# Altium schematic sheet 习题二.SchDoc
size A3
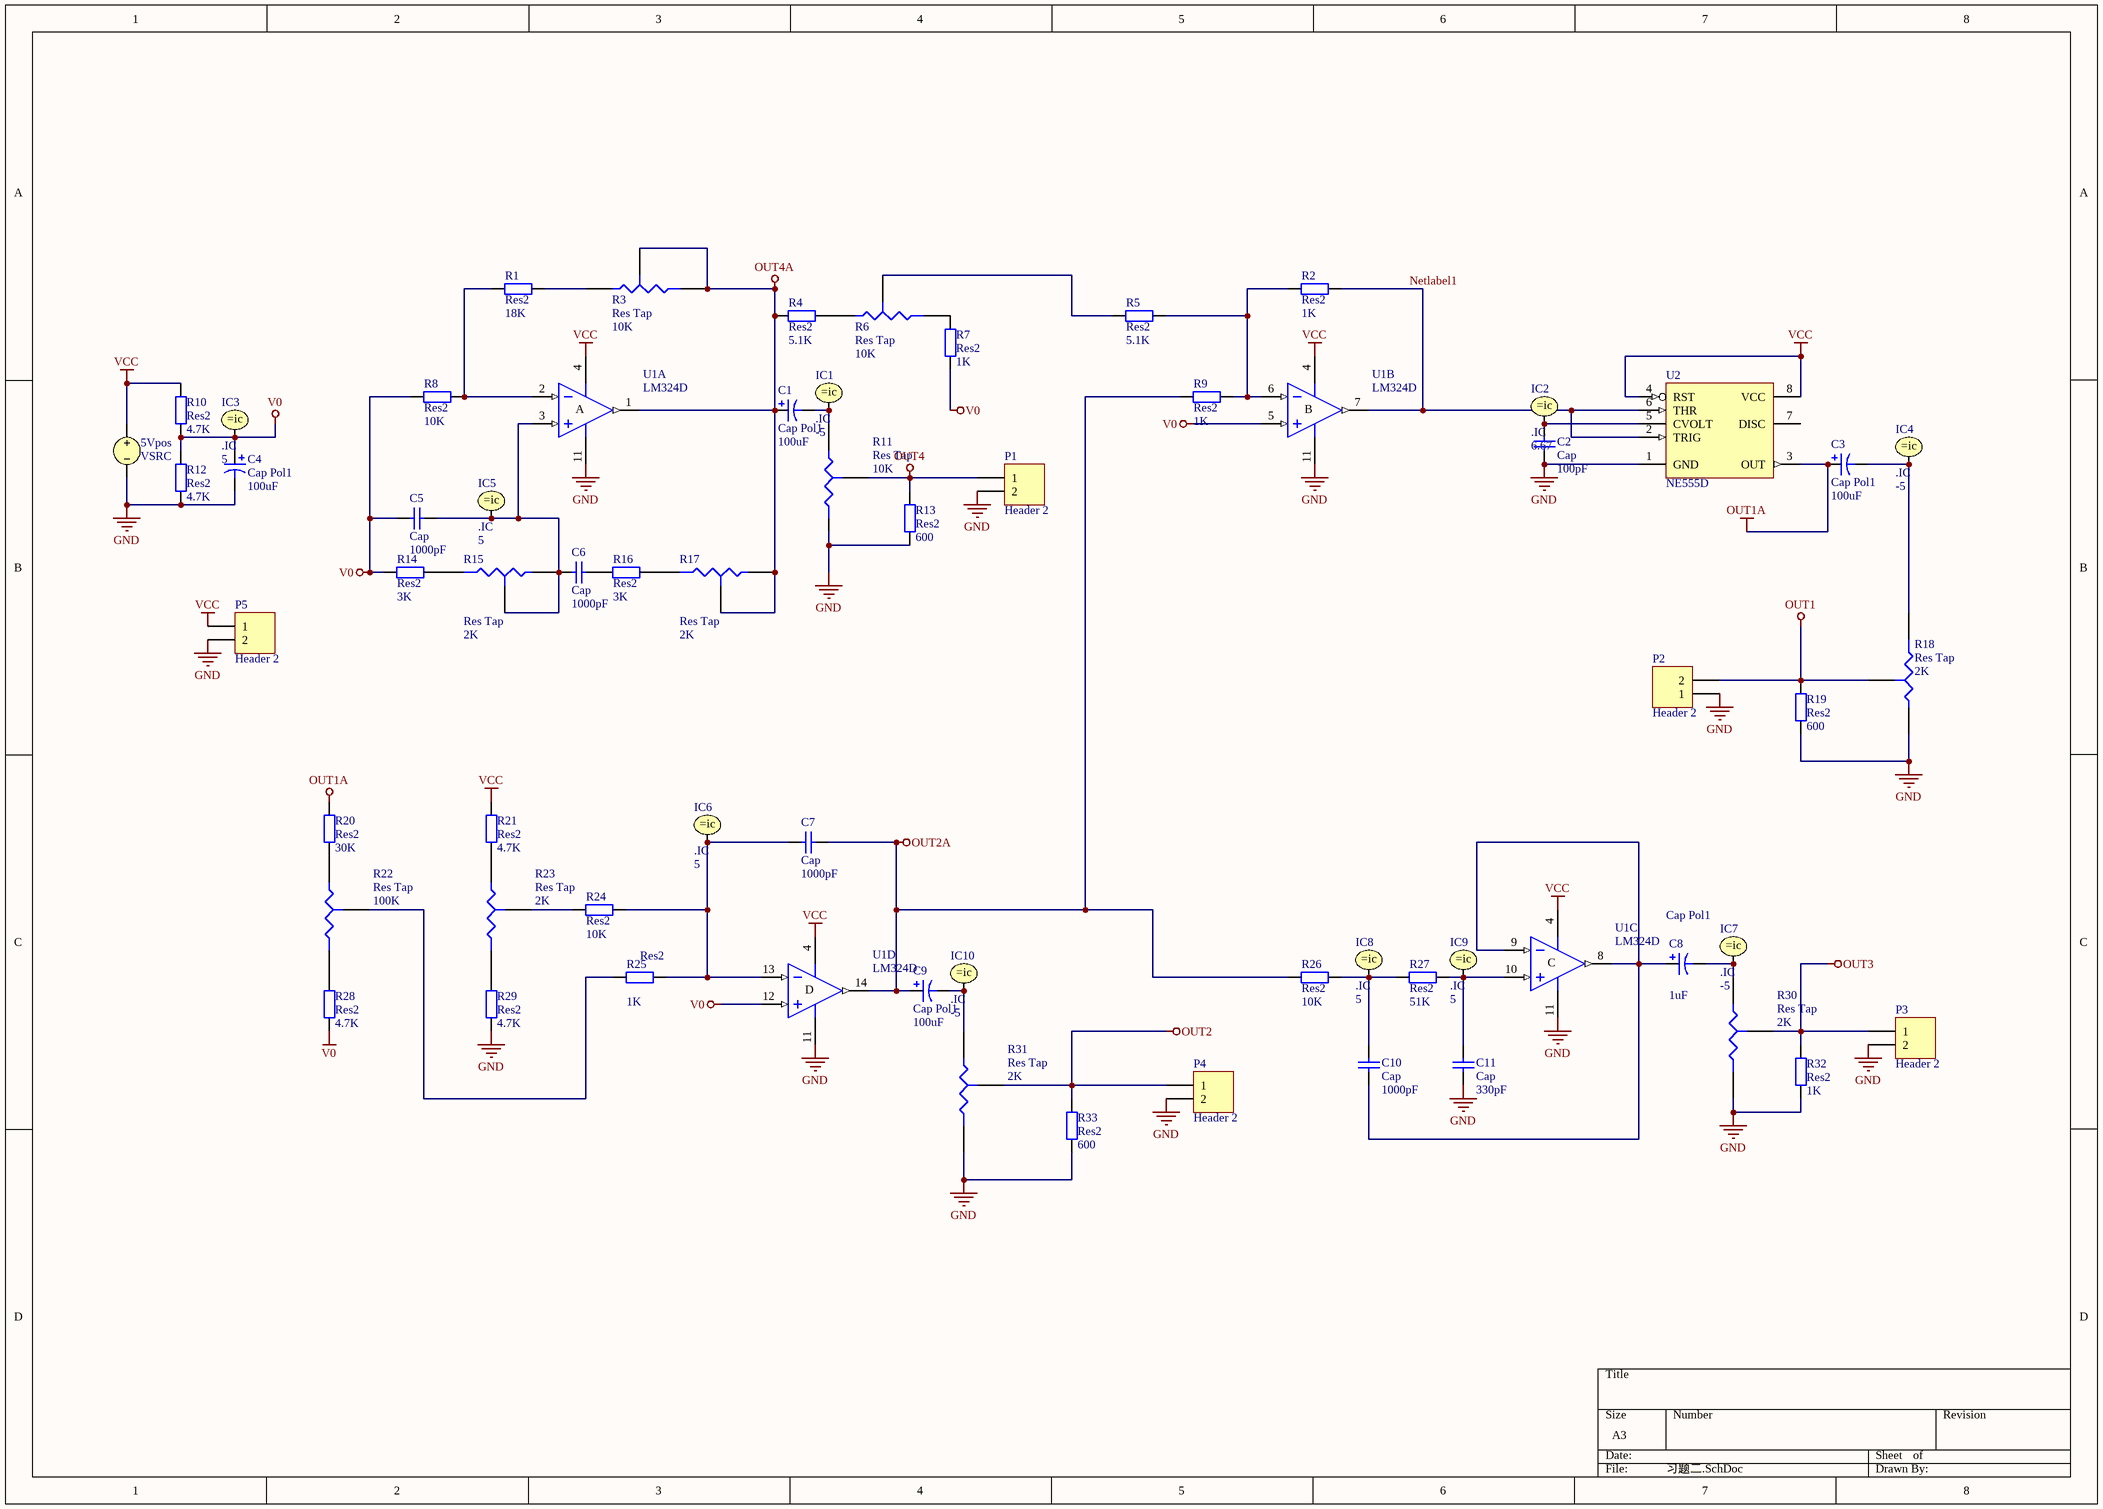
[diagram p0: 习题二.SchDoc]

## Parts
5Vpos  VSRC  [PIN1]
C1  Cap Pol1  value 100uF  [LC-CASE-C_6032]
C2  Cap  value 100pF  [LC-0805_C]
C3  Cap Pol1  value 100uF  [LC-CASE-C_6032]
C4  Cap Pol1  value 100uF  [C-RB-5.0/10]
C5  Cap  value 1000pF  [LC-0805_C]
C6  Cap  value 1000pF  [LC-0805_C]
C7  Cap  value 1000pF  [LC-0805_C]
C8  Cap Pol1  value 1uF  [LC-CASE-C_6032]
C9  Cap Pol1  value 100uF  [LC-CASE-C_6032]
C10  Cap  value 1000pF  [LC-0805_C]
C11  Cap  value 330pF  [LC-0805_C]
IC1  .IC  Initial Voltage: -5
IC2  .IC  Initial Voltage: 6.67
IC3  .IC  Initial Voltage: 5
IC4  .IC  Initial Voltage: -5
IC5  .IC  Initial Voltage: 5
IC6  .IC  Initial Voltage: 5
IC7  .IC  Initial Voltage: -5
IC8  .IC  Initial Voltage: 5
IC9  .IC  Initial Voltage: 5
IC10  .IC  Initial Voltage: -5
P1  Header 2  [HDR1X2]
P2  Header 2  [HDR1X2]
P3  Header 2  [HDR1X2]
P4  Header 2  [HDR1X2]
P5  Header 2  [HDR1X2]
R1  Res2  value 18K  [LC-0805_R]
R2  Res2  value 1K  [LC-0805_R]
R3  Res Tap  value 10K  [电位器]
R4  Res2  value 5.1K  [LC-0805_R]
R5  Res2  value 5.1K  [LC-0805_R]
R6  Res Tap  value 10K  [电位器]
R7  Res2  value 1K  [LC-0805_R]
R8  Res2  value 10K  [LC-0805_R]
R9  Res2  value 1K  [LC-0805_R]
R10  Res2  value 4.7K  [LC-0805_R]
R11  Res Tap  value 10K  [电位器]
R12  Res2  value 4.7K  [LC-0805_R]
R13  Res2  value 600  [LC-0805_R]
R14  Res2  value 3K  [LC-0805_R]
R15  Res Tap  value 2K  [电位器]
R16  Res2  value 3K  [LC-0805_R]
R17  Res Tap  value 2K  [电位器]
R18  Res Tap  value 2K  [电位器]
R19  Res2  value 600  [LC-0805_R]
R20  Res2  value 30K  [LC-0805_R]
R21  Res2  value 4.7K  [LC-0805_R]
R22  Res Tap  value 100K  [电位器]
R23  Res Tap  value 2K  [电位器]
R24  Res2  value 10K  [LC-0805_R]
R25  Res2  value 1K  [LC-0805_R]
R26  Res2  value 10K  [LC-0805_R]
R27  Res2  value 51K  [LC-0805_R]
R28  Res2  value 4.7K  [LC-0805_R]
R29  Res2  value 4.7K  [LC-0805_R]
R30  Res Tap  value 2K  [电位器]
R31  Res Tap  value 2K  [电位器]
R32  Res2  value 1K  [LC-0805_R]
R33  Res2  value 600  [LC-0805_R]
U1  LM324D  [SO14_N]  (parts A,B,C,D of 4)
U2  NE555D  [D008_N]

## Nets
GND: 5Vpos.2 C2.1 C4.2 C11.1 P1.2 P2.1 P3.2 P4.2 P5.2 R11.2(B) R12.1 R13.1 R18.1(A) R19.1 R29.1 R30.2(B) R31.2(B) R32.1 R33.1 U1.11(V-) U2.1(GND)
OUT1: P2.2 R18.3(TAP) R19.2
OUT1A: C3.1 R20.2 U2.3(OUT)
OUT2: P4.1 R31.3(TAP) R33.2
OUT2A: C7.2 C9.1 R9.1 R26.1 U1.14(OUT)
OUT3: P3.1 R30.3(TAP) R32.2
OUT4: P1.1 R11.3(TAP) R13.2
OUT4A: C1.1 R3.2(B) R3.3(TAP) R4.1 R17.1(A) R17.3(TAP) U1.1(OUT)
V0: C4.1 C5.1 IC3.1 R7.1 R8.1 R10.1 R12.2 R14.1 R28.1 U1.5(IN+) U1.12(IN+)
VCC: 5Vpos.1 P5.1 R10.2 R21.2 U1.4(V+) U2.4(RST) U2.8(VCC)
Netlabel1: R2.2 U1.7(OUT) U2.2(TRIG) U2.6(THR)
NetC1_2: C1.2 IC1.1 R11.1(A)
NetC2_2: C2.2 IC2.1 U2.5(CVOLT)
NetC3_2: C3.2 IC4.1 R18.2(B)
NetC5_2: C5.2 C6.1 IC5.1 R15.1(A) R15.3(TAP) U1.3(IN+)
NetC6_2: C6.2 R16.1
NetC7_1: C7.1 IC6.1 R24.2 R25.2 U1.13(IN-)
NetC8_1: C8.1 C10.1 U1.8(OUT) U1.9(IN-)
NetC8_2: C8.2 IC7.1 R30.1(A)
NetC9_2: C9.2 IC10.1 R31.1(A)
NetC10_2: C10.2 IC8.1 R26.2 R27.1
NetC11_2: C11.2 IC9.1 R27.2 U1.10(IN+)
NetR1_1: R1.1 R8.2 U1.2(IN-)
NetR1_2: R1.2 R3.1(A)
NetR2_1: R2.1 R5.2 R9.2 U1.6(IN-)
NetR4_2: R4.2 R6.1(A)
NetR5_1: R5.1 R6.3(TAP)
NetR6_2: R6.2(B) R7.2
NetR14_2: R14.2 R15.2(B)
NetR16_2: R16.2 R17.2(B)
NetR20_1: R20.1 R22.1(A)
NetR21_1: R21.1 R23.1(A)
NetR22_2: R22.2(B) R28.2
NetR22_3: R22.3(TAP) R25.1
NetR23_2: R23.2(B) R29.2
NetR23_3: R23.3(TAP) R24.1

Not connected (* = marked no-connect by the designer): U2 7(DISC)

## Notes on the sheet
- (in symbol LM324D, part A) A
- (in symbol LM324D, part B) B
- (in symbol LM324D, part C) C
- (in symbol LM324D, part D) D

## Library data of the parts
5Vpos = VSRC: Voltage Source; Note: PCB Footprint - Not required; Value: +10; Published: 8-Jun-2000; LatestRevisionDate: 17-Jul-2002; LatestRevisionNote: Re-released for DXP Platform.; PackageReference: Not Applicable; Publisher: Altium Limited
C1 C3 C4 C8 C9 = Cap Pol1: Polarized Capacitor (Radial); Published: 8-Jun-2000; LatestRevisionDate: 17-Jul-2002; LatestRevisionNote: Re-released for DXP Platform.; PackageReference: RB7.6-15; Publisher: Altium Limited
C2 C5-C7 C10 C11 = Cap: Capacitor; Published: 8-Jun-2000; LatestRevisionDate: 17-Jul-2002; LatestRevisionNote: Re-released for DXP Platform.; PackageReference: RAD-0.3; Publisher: Altium Limited
IC1-IC10 = .IC: Initial Condition; Published: 8-Jun-2000; LatestRevisionDate: 17-Jul-2002; LatestRevisionNote: Re-released for DXP Platform.; PackageReference: Not Applicable; Publisher: Altium Limited
P1-P5 = Header 2: Header, 2-Pin; LatestRevisionDate: 17-Jul-2002; LatestRevisionNote: Re-released for DXP Platform.; Publisher: Altium Limited
R1 R2 R4 R5 R7-R10 R12-R14 R16 R19-R21 R24-R29 R32 R33 = Res2: Resistor; Published: 8-Jun-2000; LatestRevisionDate: 17-Jul-2002; LatestRevisionNote: Re-released for DXP Platform.; PackageReference: AXIAL-0.4; Publisher: Altium Limited
R3 R22 R23 = Res Tap: Tapped Resistor; Sim Note: Enter the Resistance value and the set point into parameter fields.; Set Position: 0.5; Published: 24-Mar-1999; LatestRevisionDate: 17-Jul-2002; LatestRevisionNote: Re-released for DXP Platform.; PackageReference: VR3; Publisher: Altium Limited
R6 R30 = Res Tap: Tapped Resistor; Sim Note: Enter the Resistance value and the set point into parameter fields.; Set Position: 0.8; Published: 24-Mar-1999; LatestRevisionDate: 17-Jul-2002; LatestRevisionNote: Re-released for DXP Platform.; PackageReference: VR3; Publisher: Altium Limited
R11 = Res Tap: Tapped Resistor; Sim Note: Enter the Resistance value and the set point into parameter fields.; Set Position: 0.69; Published: 24-Mar-1999; LatestRevisionDate: 17-Jul-2002; LatestRevisionNote: Re-released for DXP Platform.; PackageReference: VR3; Publisher: Altium Limited
R15 R17 = Res Tap: Tapped Resistor; Sim Note: Enter the Resistance value and the set point into parameter fields.; Set Position: 0.9; Published: 24-Mar-1999; LatestRevisionDate: 17-Jul-2002; LatestRevisionNote: Re-released for DXP Platform.; PackageReference: VR3; Publisher: Altium Limited
R18 = Res Tap: Tapped Resistor; Sim Note: Enter the Resistance value and the set point into parameter fields.; Set Position: 0.15; Published: 24-Mar-1999; LatestRevisionDate: 17-Jul-2002; LatestRevisionNote: Re-released for DXP Platform.; PackageReference: VR3; Publisher: Altium Limited
R31 = Res Tap: Tapped Resistor; Sim Note: Enter the Resistance value and the set point into parameter fields.; Set Position: 0.6; Published: 24-Mar-1999; LatestRevisionDate: 17-Jul-2002; LatestRevisionNote: Re-released for DXP Platform.; PackageReference: VR3; Publisher: Altium Limited
U1 = LM324D: Low-Power Quad Operational Amplifier; Published: 24-Aug-2001; LatestRevisionDate: 13-Apr-2006; LatestRevisionNote: IPC-7351 Footprint Added.; DatasheetVersion: Jun-1999; PackageVersion: Sep-1998; PackageReference: SO14; Publisher: Altium Limited; PackageDescription: 14-Pin Small Outline Integrated Circuit 1.27 mm Pitch; Code_IPC: SOIC127P600-14; ComponentLink1Description: Manufacturer Link; ComponentLink1URL: http://www.st.com/; ComponentLink2Description: Datasheet; ComponentLink2URL: http://www.st.com/stonline/products/literature/ds/2156/lm324.pdf
U2 = NE555D: Precision Timer; Published: 16-Jan-2001; LatestRevisionDate: 13-Apr-2006; LatestRevisionNote: IPC-7351 Footprint Added.; DatasheetVersion: Feb-1992; PackageVersion: Jan-1998; PackageReference: D008; Publisher: Altium Limited; PackageDescription: 8-Pin Small Outline Integrated Circuit 1.27 mm Pitch; Code_IPC: SOIC127P600-8; ComponentLink1Description: Manufacturer Link; ComponentLink1URL: http://www.ti.com/; ComponentLink2Description: Datasheet; ComponentLink2URL: http://www-s.ti.com/sc/ds/ne555.pdf